# EAGLE design Compressor_Remote_Cntrl_Board (EAGLE 8.7.1)
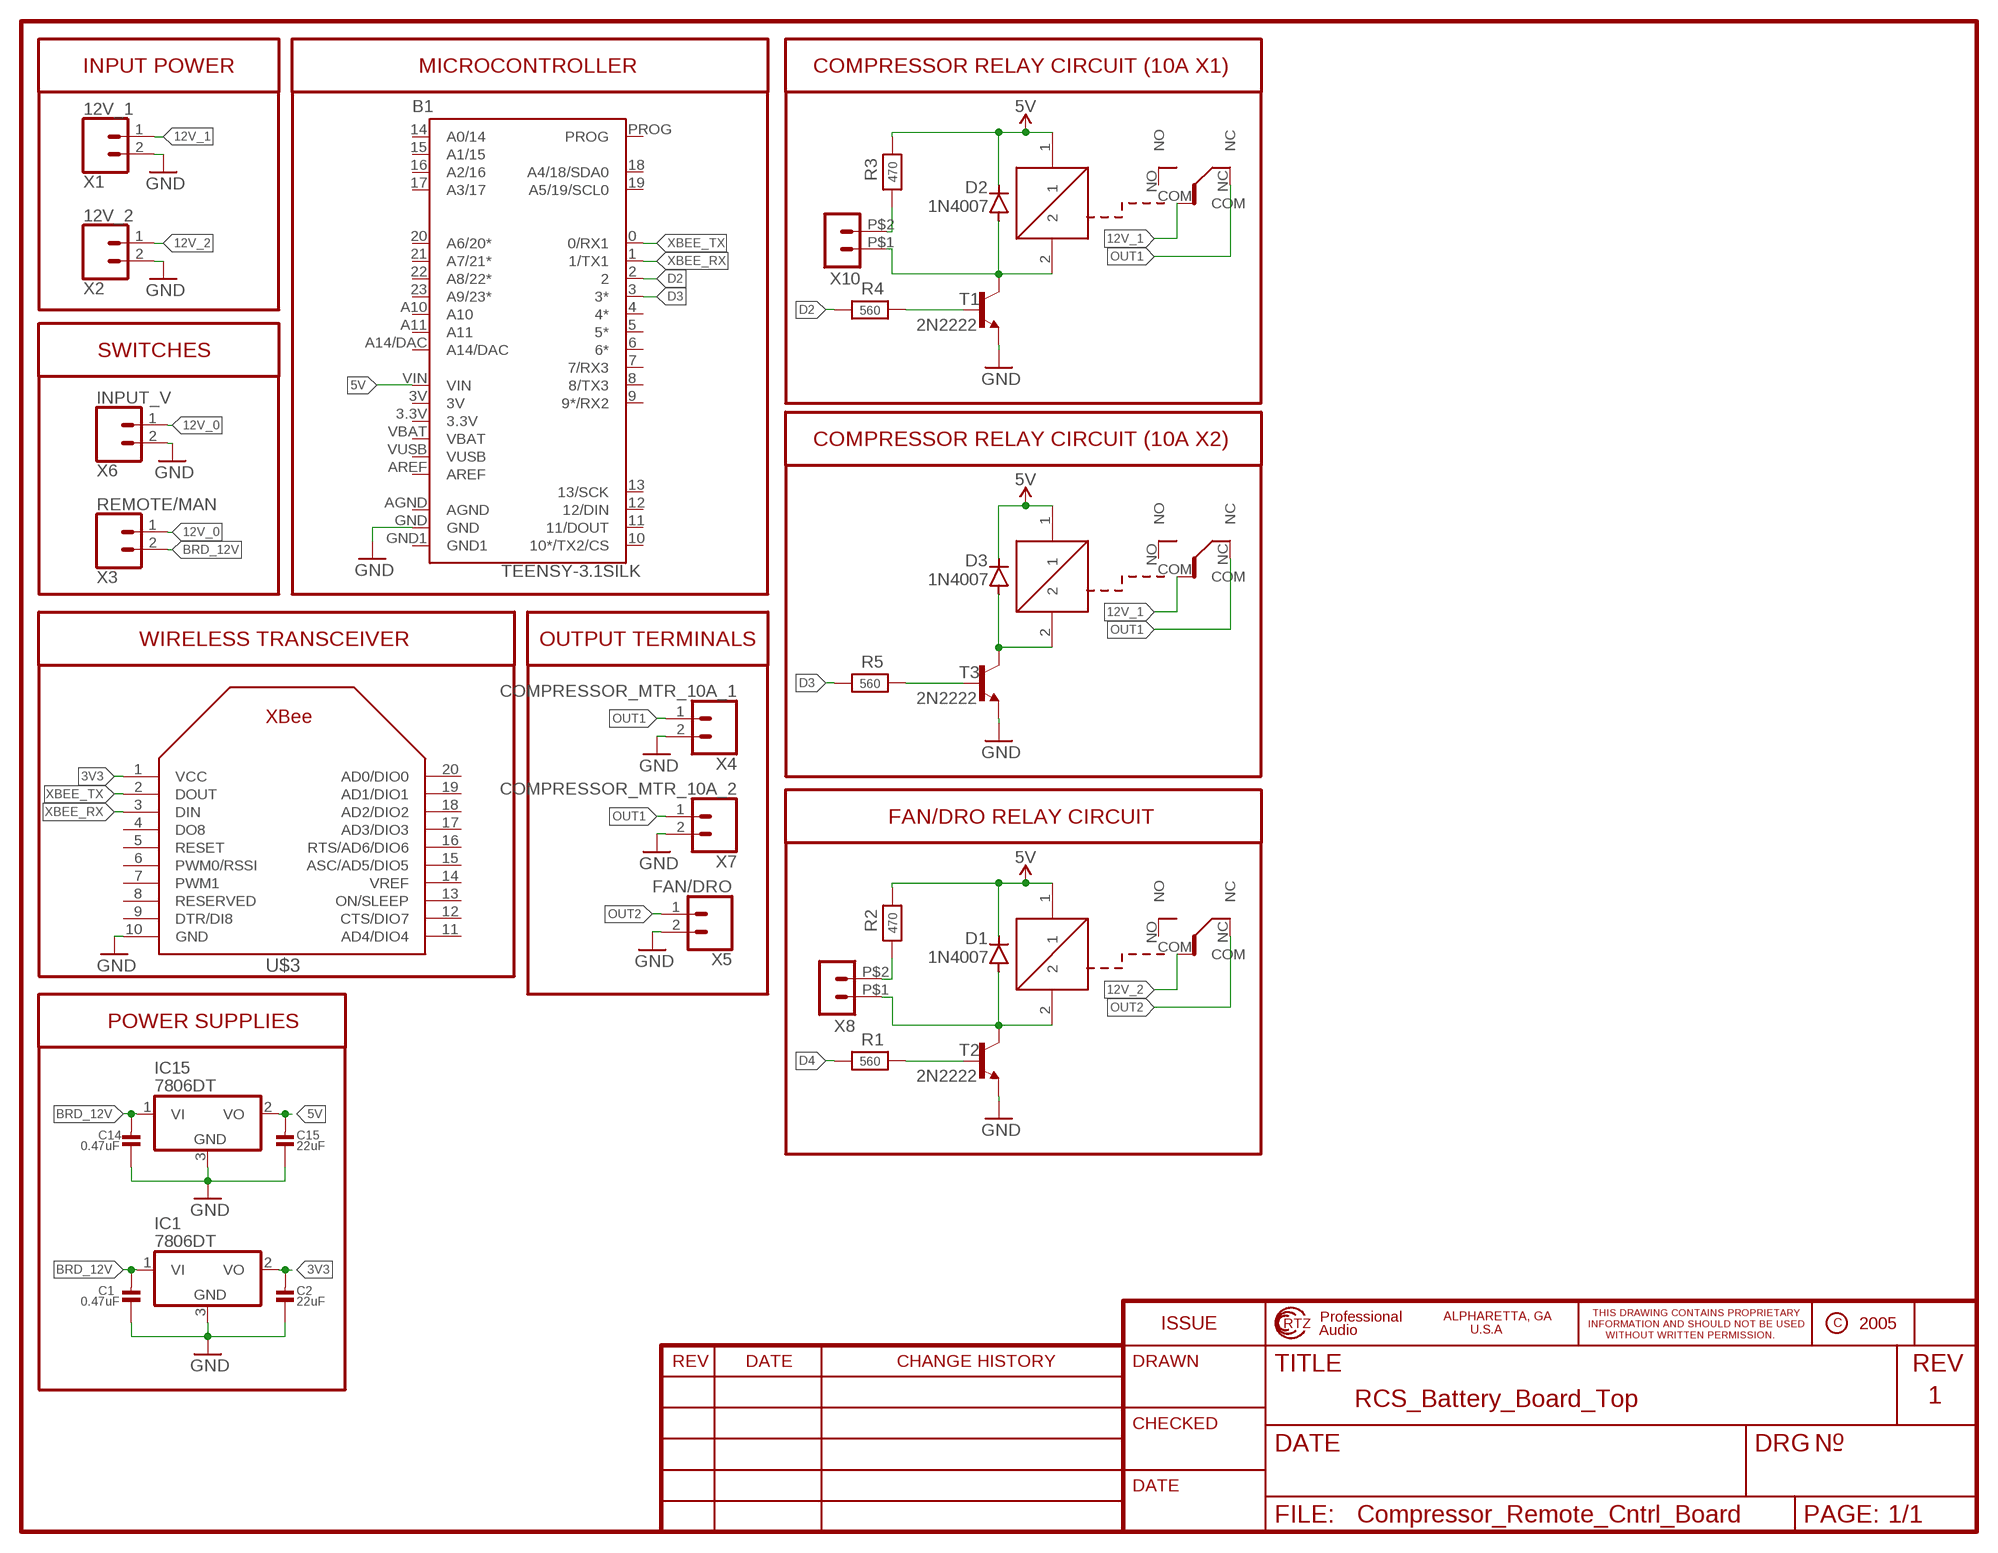
[diagram p0: schematic, sheet 1]

## Parts
B1  TEENSY-3.1SILK  [TEENSY-3.1]
C1  0.47uF  CAP_CERAMIC0603  [0603]
C2  22uF  CAP_CERAMIC0603  [0603]
C14  0.47uF  CAP_CERAMIC0603  [0603]
C15  22uF  CAP_CERAMIC0603  [0603]
D1  1N4007  [DO-41]
D2  1N4007  [DO-41]
D3  1N4007  [DO-41]
IC1  7806DT  [TO252]
IC15  7806DT  [TO252]
R1  560  RESISTOR0805  [0805]
R2  470  RESISTOR0805  [0805]
R3  470  RESISTOR0805  [0805]
R4  560  RESISTOR0805  [0805]
R5  560  RESISTOR0805  [0805]
T1  2N2222  [TO92-EBC-OVAL]
T2  2N2222  [TO92-EBC-OVAL]
T3  2N2222  [TO92-EBC-OVAL]
U$1  RW-SH  [RW-SH]
U$2  RW-SH  [RW-SH]
U$3  XBEE  [XBEE]
U$4  RW-SH  [RW-SH]
X1  12V_1  CONN_025MM  [SCREWTERMINAL-5MM-2]
X2  12V_2  CONN_025MM  [SCREWTERMINAL-5MM-2]
X3  REMOTE/MAN  CONN_025MM  [SCREWTERMINAL-5MM-2]
X4  COMPRESSOR_MTR_10A_1  CONN_025MM  [SCREWTERMINAL-5MM-2]
X5  FAN/DRO  CONN_025MM  [SCREWTERMINAL-5MM-2]
X6  INPUT_V  CONN_025MM  [SCREWTERMINAL-5MM-2]
X7  COMPRESSOR_MTR_10A_2  CONN_025MM  [SCREWTERMINAL-5MM-2]
X8  HEADER_POS2_43650-0215  [43650-0215]
X10  HEADER_POS2_43650-0215  [43650-0215]

## Nets
3V3: C2.2 IC1.2(VO) U$3.1(VCC)
5V: B1.VIN C15.2 D1.C D2.C D3.C IC15.2(VO) R2.2 R3.2 U$1.1 U$2.1 U$4.1
12V_0: X3.1 X6.1
12V_1: U$2.COM U$4.COM X1.1
12V_2: U$1.COM X2.1
BRD_12V: C1.2 C14.2 IC1.1(VI) IC15.1(VI) X3.2
D2: B1.2 R4.1
D3: B1.3(3*) R5.1
D4: R1.1
GND: B1.GND C1.1 C2.1 C14.1 C15.1 IC1.3(GND) IC15.3(GND) T1.E T2.E T3.E U$3.10(GND) X1.2 X2.2 X4.2 X5.2 X6.2 X7.2
N$1: D1.A T2.C U$1.2 X8.P$1
N$2: R1.2 T2.B
N$3: R2.1 X8.P$2
N$4: D3.A T3.C U$4.2
N$5: R5.2 T3.B
N$6: R4.2 T1.B
N$7: D2.A T1.C U$2.2 X10.P$1
N$8: R3.1 X10.P$2
OUT1: U$2.NC U$4.NC X4.1 X7.1
OUT2: U$1.NC X5.1
XBEE_RX: B1.1(1/TX1) U$3.3(DIN)
XBEE_TX: B1.0(0/RX1) U$3.2(DOUT)
Unconnected: B1.4(4*) B1.5(5*) B1.6(6*) B1.7(7/RX3) B1.8(8/TX3) B1.9(9*/RX2) B1.10(10*/TX2/CS) B1.11(11/DOUT) B1.12(12/DIN) B1.13(13/SCK) B1.14(A0/14) B1.15(A1/15) B1.16(A2/16) B1.17(A3/17) B1.18(A4/18/SDA0) B1.19(A5/19/SCL0) B1.20(A6/20*) B1.21(A7/21*) B1.22(A8/22*) B1.23(A9/23*) B1.A10 B1.A11 B1.A14/DAC B1.AREF B1.PROG U$1.NO U$2.NO U$3.4(DO8) U$3.5(RESET) U$3.6(PWM0/RSSI) U$3.7(PWM1) U$3.8(RESERVED) U$3.9(DTR/DI8) U$3.11(AD4/DIO4) U$3.12(CTS/DIO7) U$3.13(ON/SLEEP) U$3.14(VREF) U$3.15(ASC/AD5/DIO5) U$3.16(RTS/AD6/DIO6) U$3.17(AD3/DIO3) U$3.18(AD2/DIO2) U$3.19(AD1/DIO1) U$3.20(AD0/DIO0) U$4.NO

## Notes on the sheet
- INPUT POWER | MICROCONTROLLER | COMPRESSOR RELAY CIRCUIT (10A X1)
- SWITCHES
- COMPRESSOR RELAY CIRCUIT (10A X2)
- WIRELESS TRANSCEIVER | OUTPUT TERMINALS
- FAN/DRO RELAY CIRCUIT
- POWER SUPPLIES
- RCS_Battery_Board_Top | 1

## Power pins joined to a net without a drawn wire
3.3V: B1.3.3V
3V: B1.3V
AGND: B1.AGND
GND1: B1.GND1
VBAT: B1.VBAT
VUSB: B1.VUSB

## Library data of the parts
B1 = SparkFun-Boards:TEENSY-3.1: Teensy 3+ Footprint Mechanical footprint with connectors for Teensy Development Board with ARM Cortex. SparkFun Products: Teensy 3.2 <https://www.sparkfun.com/products/13736> Teensy LC <https://www.sparkfun.com/products/13305>; SF_ID: DEV-12646
C1 C2 C14 C15 = microbuilder:CAP_CERAMIC: Ceramic Capacitors 0402 - 0402 Surface Mount Capacitors 16pF 50V 5% [Digikey: 445-4899-2-ND] 18pF 50V 5% [Digikey: 490-1281-2-ND] 22pF 50V 5% [Digikey: 490-1283-2-ND] 68pF 50V 5% [Digikey: 490-1289-2-ND] 0.1uF 10V 10% [Digikey: 490-1318-2-ND] 1.0uF 6.3V 10% [Digikey: 490-1320-2-ND] 0603 - 0603 Surface Mount Capacitors 16 pF 50V 5% [Digikey: 445-5051-2-ND] 22 pF 50V [Digikey: PCC220ACVTR-ND] 33 pF 50V 5% [Digikey: 490-1415-1-ND] 56pF 50V 5% [Digikey: 490-1421-1-ND] 220pF 50V 5% [Digikey: 445-1285-1-ND] 680 pF 50V 2200 pF 50V 5% C0G [Digikey: 445-1297-1-ND] 5600 pF 100V 5% X7R [Digikey: 478-3711-1-ND] 0.1 µF 25V 10% [Digikey: PCC2277TR-ND] 0.22 µF 16V 10% X7R [Digikey: 445-1318-1-ND] 1.0 µF 25V 10% [Digikey: 445-5146-2-ND] 0603 - RF Specific 3pF 250V +/-0.1pF RF [Digikey: 712-1347-1-ND] 18 pF 250V 5% [Digikey: 478-3505-1-ND or 712-1322-1-ND] 56 pF 250V 5% C0G RF [Digikey: 490-4867-1-ND] 68 pF 250V RF [Digikey: 490-4868-1-ND] 0805 - 0805 Surface Mount Capacitors 220 pF 250V 2% RF Ceramic Capacitor [Digikey: 712-1398-1-ND] 1000 pF 50V 2% NP0 Ceramic Capacitor [Digikey: 478-3760-1-ND] 0.1 µF 25V 10% Ceramic Capacitor [Digikey: PCC1828TR-ND] 1.0 µF 16V 10% Ceramic Capacitor[Digikey: 490-1691-2-ND] 10.0 µF 10V 10% Ceramic Capacitor[Digikey: 709-1228-1-ND] 10.0 uF 16V 10% Ceramic Capacitor [Digikey: 478-5165-2-ND] 47 uF 6.3V 20% Ceramic Capacitor [Digikey: 587-1779-1-ND or 399-5506-1-ND] 1206 - 1206 Surface Mount Capacitors 47uF 10V 20% Ceramic Capacitor [Digikey: 490-5528-1-ND or 399-5508-1-ND or 445-6010-1-ND]
D1-D3 = Diodes:1N4007: DIODE GEN PURP 1KV 1A DO41 Manufacturer's datasheet <https://www.mccsemi.com/pdf/Products/1N4001-1N4007(DO-41).pdf>; CREATED_BY: PCBLayout.com; DIGIKEY_PART_NUMBER: 1N4007MSCT-ND; MANUFACTURER: Micro Commercial Co; MPN: 1N4007; PACKAGE: DO-41
IC1 IC15 = adafruit:78*: Positive VOLTAGE REGULATOR Added bigger pads to the TO-92 package
R1-R5 = microbuilder:RESISTOR: Resistors 0402 - 0402 Surface Mount Package 22 Ohm 1% 1/16W [Digikey: 311-22.0LRTR-ND] 33 Ohm 5% 1/16W 1.0K 5% 1/16W 1.5K 5% 1/16W 2.0K 1% 1/16W 10.0K 1% 1/16W [Digikey: 311-10.0KLRTR-ND] 10.0K 5% 1/16W [Digikey: RMCF0402JT10K0TR-ND] 12.1K 1% 1/16W [Digikey: 311-22.0LRTR-ND] 100.0K 5% 1/16W 0603 - 0603 Surface Mount Package 0 Ohm 1/10 Watt 1% Resistor 15 Ohm 1/10 Watt 1% Resistor 33 Ohm 1/10 Watt 1% Resistor 49.9 Ohm 1/10 Watt 1% Resistor 100 Ohm 1/10 Watt 1% Resistor 150 Ohm 1/10 Watt 1% Resistor 240 Ohm 1/10 Watt 1% Resistor 390 Ohm 1/10 Watt 1% Resistor 560 Ohm 1/10 Watt 1% Resistor 680 Ohm 1/10 Watt 1% Resistor 750 Ohm 1/10 Watt 1% Resistor 1.0K Ohm 1/10 Watt 1% Resistor 1.5K Ohm 1/10 Watt 1% Resistor 2.0K Ohm 1/10 Watt 1% Resistor 2.2K Ohm 1/10 Watt 1% Resistor 3.3K Ohm 1/10 Watt 1% Resistor 4.7K Ohm 1/10 Watt 1% Resistor 10.0K Ohm 1/10 Watt 1% Resistor 12.0K Ohm 1/10 Watt 1% Resistor 12.1K Ohm 1/10 Watt 1% Resistor 20.0K Ohm 1/10 Watt 1% Resistor 33.0K Ohm 1/10 Watt 1% Resistor 100.0K Ohm 1/10 Watt 1% Resistor 0805 - 0805 Surface Mount Package 0 Ohm 1/8 Watt 1% Resistor 33 Ohm 1/8 Watt 1% Resistor 100 Ohm 1/8 Watt 1% Resistor 150 Ohm 1/8 Watt 1% Resistor 200 Ohm 1/8 Watt 1% Resistor 240 Ohm 1/8 Watt 1% Resistor 330 Ohm 1/8 Watt 1% Resistor 390 Ohm 1/8 Watt 1% Resistor 470 Ohm 1/8 Watt 1% Resistor 1.0K Ohm 1/8 Watt 1% Resistor 1.5K Ohm 1/8 Watt 1% Resistor 2.0K Ohm 1/8 Watt 1% Resistor 4.7K Ohm 1/8 Watt 1% Resistor 5.1K Ohm 1/8 Watt 1% Resistor 5.6K Ohm 1/8 Watt 1% Resistor 10.0K Ohm 1/8 Watt 1% Resistor 22.0K Ohm 1/8 Watt 1% Resistor 33.0K Ohm 1/8 Watt 1% Resistor 100K Ohm 1/8 Watt 1% Resistor 1206 - 1206 Surface Mount Package 2012 - 2010 Surface Mount Package 0.11 Ohm 1/2 Watt 1% Resistor - Digikey: RHM.11UCT-ND
T1-T3 = adafruit:2N2222: NPN TRANSISTOR Big oval pads
U$1 U$2 U$4 = goodsky1:RW-SH
U$3 = adafruit:XBEE
X1-X7 = SparkFun-Connectors:CONN_02: Multi connection point. Often used as Generic Header-pin footprint for 0.1 inch spaced/style header connections On any of the 0.1 inch spaced packages, you can populate with these: Break Away Headers - Straight <https://www.sparkfun.com/products/116> (PRT-00116) Break Away Male Headers - Right Angle <https://www.sparkfun.com/products/553> (PRT-00553) Female Headers <https://www.sparkfun.com/products/115> (PRT-00115) Break Away Headers - Machine Pin <https://www.sparkfun.com/products/117> (PRT-00117) Break Away Female Headers - Swiss Machine Pin <https://www.sparkfun.com/products/743> (PRT-00743) For SCREWTERMINALS and SPRING TERMINALS visit here: Screw Terimnals on SparkFun.com <https://www.sparkfun.com/search/results?term=Screw+Terminals> (5mm/3.5mm/2.54mm spacing) This device is also useful as a general connection point to wire up your design to another part of your project. Our various solder wires solder well into these plated through hole pads. Hook-Up Wire - Assortment (Stranded, 22 AWG) <https://www.sparkfun.com/products/11375> (PRT-11375) Hook-Up Wire - Assortment (Solid Core, 22 AWG) <https://www.sparkfun.com/products/11367> (PRT-11367) View the entire wire category on our website here <https://www.sparkfun.com/categories/141> Special notes: Molex polarized connector foot print use with: PRT-08233 with associated crimp pins and housings. 2.54_SCREWTERM for use with PRT-10571. 3.5mm Screw Terminal footprints for PRT-08084 5mm Screw Terminal footprints for use with PRT-08432; SF_SKU: PRT-08432
X8 X10 = con-molex-micro-fit-3_0:HEADER_POS2_?: Molex - Micro-Fit 3.0 Series connector, 3.00mm (0.118") pitch header, 2 positions.

## Board
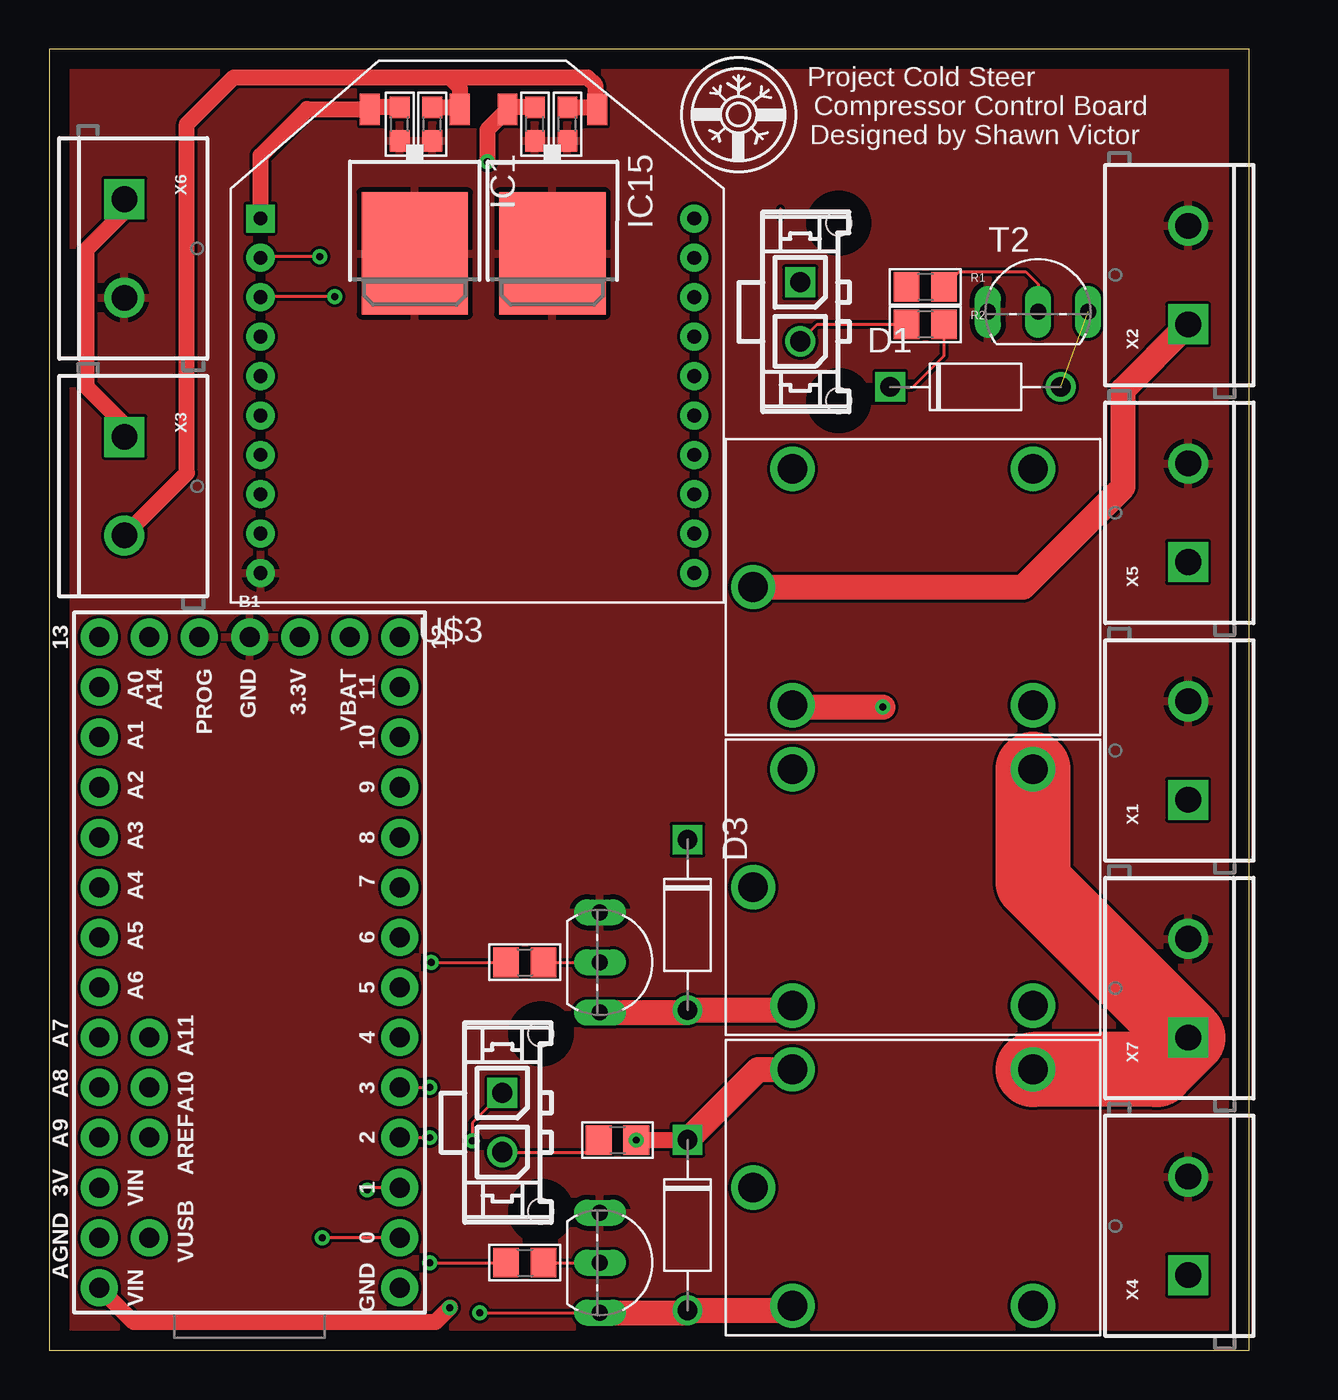
[diagram p1: board, top side]
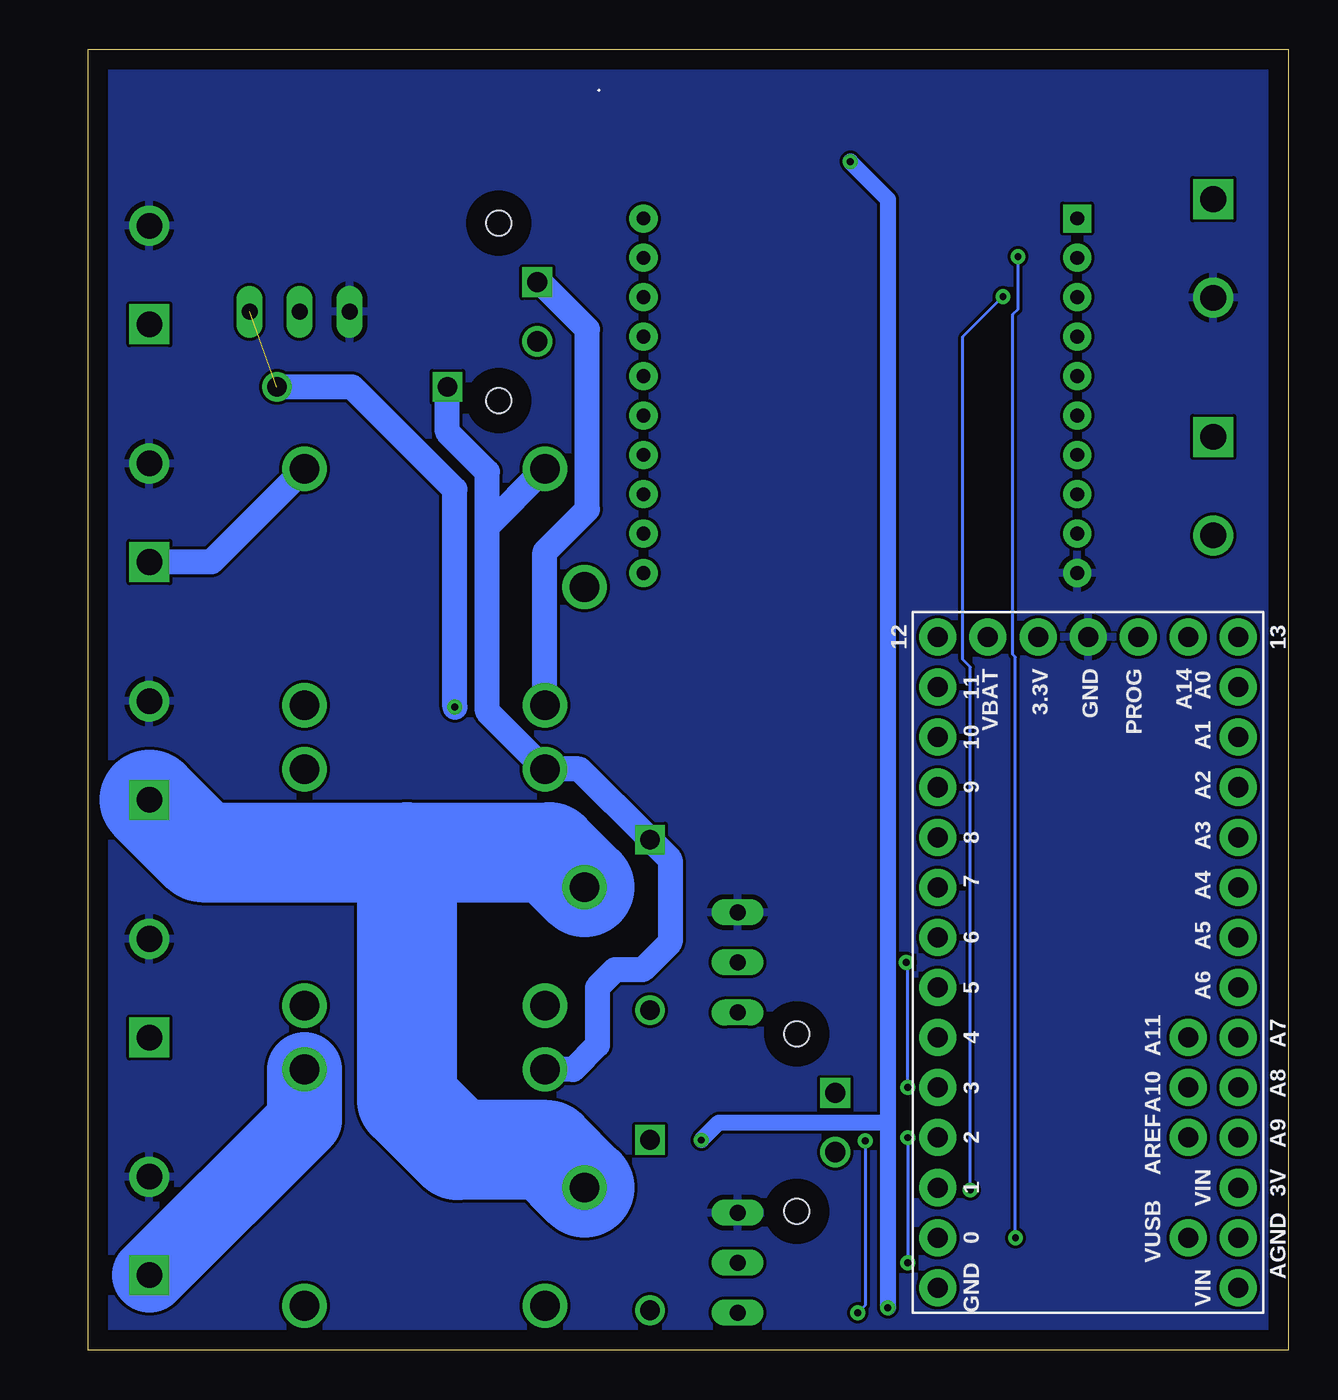
[diagram p2: board, bottom side, seen from below]

Size 60.88 x 66.03 mm. Coordinates in mm from the lower left corner, seen from the top.
Outline: 0,0 60.88,0 60.88,66.03 0,66.03 0,0
Copper layers (1*16): Top 0.035mm / dielectric 1.5mm / Bottom 0.035mm
Design rules "default": minimum track width 6mil, minimum drill 0.35mm, track to track 6mil, track to pad 6mil, pad to pad 6mil, via to via 6mil, smd to smd 6mil, copper to edge 40mil, drill to drill 6mil, minimum pad ring 10mil, minimum via ring 8mil, stop-mask expansion 4mil, vias tented up to drill 0mil, thermal gap 10mil

### Footprints (pad centres in the part's own frame; a part is rotated, then mirrored left to right if it is on the bottom)
TEENSY-3.1 = drill 1.016 pad 1.88: 0 7.62,-13.97; 1 7.62,-11.43; 2 7.62,-8.89; 3 7.62,-6.35; 3.3V 2.54,16.51; 3V -7.62,-11.43; 4 7.62,-3.81; 5 7.62,-1.27; 6 7.62,1.27; 7 7.62,3.81; 8 7.62,6.35; 9 7.62,8.89; 10 7.62,11.43; 11 7.62,13.97; 12 7.62,16.51; 13 -7.62,16.51; 14 -7.62,13.97; 15 -7.62,11.43; 16 -7.62,8.89; 17 -7.62,6.35; 18 -7.62,3.81; 19 -7.62,1.27; 20 -7.62,-1.27; 21 -7.62,-3.81; 22 -7.62,-6.35; 23 -7.62,-8.89; A10 -5.08,-6.35; A11 -5.08,-3.81; A14/DAC -5.08,16.51; AGND -7.62,-13.97; AREF -5.08,-8.89; GND 0,16.51; GND1 7.62,-16.51; PROG -2.54,16.51; VBAT 5.08,16.51; VIN -7.62,-16.51; VUSB -5.08,-13.97
0603 = smd 1.1 x 1: 1 -0.85,0; 2 0.85,0
DO-41 = drill 1: A 4.325,0 | drill 1 square: C -4.325,0
TO252 = smd 1 x 1.6: 1 -2.28,-4.8; 2 2.28,-4.8 | smd 5.4 x 6.2: 3 0,2.5
0805 = smd 1.3 x 1.5: 1 -0.95,0; 2 0.95,0
TO92-EBC-OVAL = drill 0.813 long: B 0,-1.27; C 2.54,-1.27; E -2.54,-1.27
RW-SH = drill 1.5: 1 -6.1,6; 2 -6.1,-6; COM -8.1,0; NC 6.1,6; NO 6.1,-6
XBEE = drill 0.7 pad 1.422 square: 1 -11,5.5 | drill 0.7 pad 1.422: 2 -11,3.5; 3 -11,1.5; 4 -11,-0.5; 5 -11,-2.5; 6 -11,-4.5; 7 -11,-6.5; 8 -11,-8.5; 9 -11,-10.5; 10 -11,-12.5; 11 11,-12.5; 12 11,-10.5; 13 11,-8.5; 14 11,-6.5; 15 11,-4.5; 16 11,-2.5; 17 11,-0.5; 18 11,1.5; 19 11,3.5; 20 11,5.5
SCREWTERMINAL-5MM-2 = drill 1.3 pad 2.032 square: 1 0,0 | drill 1.3 pad 2.032: 2 5,0
43650-0215 = drill 1.02 square: P$1 1.5,0 | drill 1.02: P$2 -1.5,0 | hole 1.27: 4.5,-1.96; -4.5,-1.96

### Placement (x,y rotation side)
B1  10.16,19.68 0 top
C1  19.43,62.23 90 top
C2  17.78,62.23 90 top
C14  26.29,62.23 90 top
C15  24.64,62.23 90 top
D1  46.99,48.89 0 top
D2  32.38,6.35 270 top
D3  32.38,21.59 270 top
IC1  18.54,58.17 180 top
IC15  25.53,58.17 180 top
R1  44.45,53.98 0 top
R2  44.45,52.07 0 top
R3  28.83,10.67 0 top
R4  24.13,4.44 0 top
R5  24.13,19.68 0 top
T1  29.21,4.44 270 top
T2  50.16,53.98 0 top
T3  29.21,19.68 270 top
U$1  43.81,38.73 0 top
U$2  43.81,8.26 0 top
U$3  21.72,51.94 0 top
U$4  43.81,23.49 0 top
X1  57.78,27.94 90 top
X2  57.78,52.07 90 top
X3  3.81,46.35 270 top
X4  57.78,3.81 90 top
X5  57.78,40 90 top
X6  3.81,58.42 270 top
X7  57.78,15.88 90 top
X8  38.1,52.7 90 top
X10  22.99,11.56 90 top

### Tracks (layer width: path | path; a pad name or v marks a point on that pad's centre or on a via)
3V3
  Top 0.813: C2.2 16.38,63.08 16.29,62.99 | 16.29,62.99 IC1.2 | U$3.1 10.72,60.63 13.08,62.99 16.29,62.99
5V  (via drill 0.35)
  Top 0.152: D1.C 43.81,48.89 45.4,50.48 R2.2
  Top 0.813: C15.2 23.36,63.08 IC15.2 22.23,61.94 v22.23,60.32 | v20.32,2.16 19.58,1.42 4.29,1.42 B1.VIN | R3.2 32.38,10.67 D2.C
  Top 1.27: D2.C 35.96,14.26 U$2.1
  Bottom 0.813: v22.23,60.32 20.32,58.42 20.32,11.56 | 20.32,11.56 v20.32,2.16 | R3.2 28.89,11.56 20.32,11.56
  Bottom 1.27: U$2.1 36.29,14.26 35.05,15.49 35.05,18.41 34.16,19.3 32.77,19.3 31.37,20.7 31.37,24.9 D3.C 35.96,29.49 U$4.1 40.64,32.42 40.64,41.81 | 40.64,41.81 U$1.1 | 40.64,41.81 40.64,44.58 42.67,46.61 42.67,48.89 D1.C
  other vias: 29.78,10.67
12V_0
  Top 0.813: X3.1 3.81,46.99 1.9,48.89 1.9,55.88 3.81,57.78 X6.1
12V_1
  Bottom 5.08: X1.1 55.12,25.27 44.7,25.27 | U$4.COM 37.49,25.27 44.7,25.27 | U$2.COM 37.62,10.16 42.16,10.16 44.7,12.7 44.7,25.27
12V_2
  Top 1.27: U$1.COM 49.4,38.73 54.48,43.81 54.48,48.77 X2.1
BRD_12V
  Top 0.813: X3.2 6.98,44.53 6.98,62.23 9.36,64.61 20.32,64.61 | 20.32,64.61 20.82,64.11 IC1.1 20.71,63.08 C1.2 | C14.2 27.69,63.08 | 27.69,63.08 IC15.1 | 20.32,64.61 27.3,64.61 27.69,64.22 27.69,63.08
D2  (via drill 0.35)
  Top 0.152: B1.2 v19.3,10.79 | v19.3,4.44 R4.1
  Bottom 0.152: v19.3,10.79 v19.3,4.44
D3  (via drill 0.35)
  Top 0.152: B1.3 v19.3,13.34 | v19.38,19.68 R5.1
  Bottom 0.152: v19.3,13.34 19.3,19.61 v19.38,19.68
GND
  pour Top: -5.08,-1.27 62.86,-1.27 62.86,66.67 -5.08,66.67
  pour Bottom: -6.35,-2.54 64.13,-2.54 64.13,67.94 -6.35,67.94
LS+
  Top 0.152: 37.11,57.94 37.09,57.49
N$1  (via drill 0.35)  (1 unrouted)
  Top 1.27: U$1.2 37.81,32.64 v42.29,32.64
  Bottom 1.27: U$1.2 37.71,40.52 35.56,42.67 35.56,51.82 37.95,54.2 X8.P$1 | v42.29,32.64 42.29,43.69 47.5,48.89 D1.A
N$2
  Top 0.152: R1.2 46.16,54.74 49.53,54.74 50.16,54.1 T2.B
N$3
  Top 0.152: X8.P$2 38.96,52.07 R2.1
N$4
  Top 1.27: U$4.2 37.48,17.27 D3.A 32.27,17.14 T3.C
N$5
  Top 0.152: R5.2 T3.B
N$6
  Top 0.152: R4.2 T1.B
N$7  (via drill 0.35)
  Top 0.152: X10.P$1 21.46,11.53 v21.46,10.62 | v21.84,1.91 T1.C
  Top 1.27: T1.C 32.27,1.91 D2.A 37.48,2.03 U$2.2
  Bottom 0.152: v21.46,10.62 21.46,2.29 v21.84,1.91
N$8
  Top 0.152: X10.P$2 27.27,10.06 R3.1
OUT1
  Top 3.81: U$2.NC 56.16,14.26 X7.1 49.91,23.74 U$4.NC
  Bottom 3.81: X4.1 49.91,11.68 U$2.NC
OUT2
  Bottom 1.27: U$1.NC 54.64,40 X5.1
XBEE_RX  (via drill 0.35)
  Top 0.152: B1.1 16.26,8.26 v16.13,8.13 | v14.48,53.47 10.74,53.47 U$3.3
  Bottom 0.152: v16.13,8.13 16.13,34.67 16.51,35.05 16.51,51.44 v14.48,53.47
XBEE_TX  (via drill 0.35)
  Top 0.152: B1.0 v13.84,5.71 | v13.72,55.5 10.77,55.5 U$3.2
  Bottom 0.152: v13.84,5.71 13.84,35.18 13.97,35.31 13.97,52.58 13.72,52.83 v13.72,55.5

### Text on the board
tPlace: Project Cold Steer | Compressor Control Board | Designed by Shawn Victor